# EAGLE design 2wd (EAGLE 7.7.0)
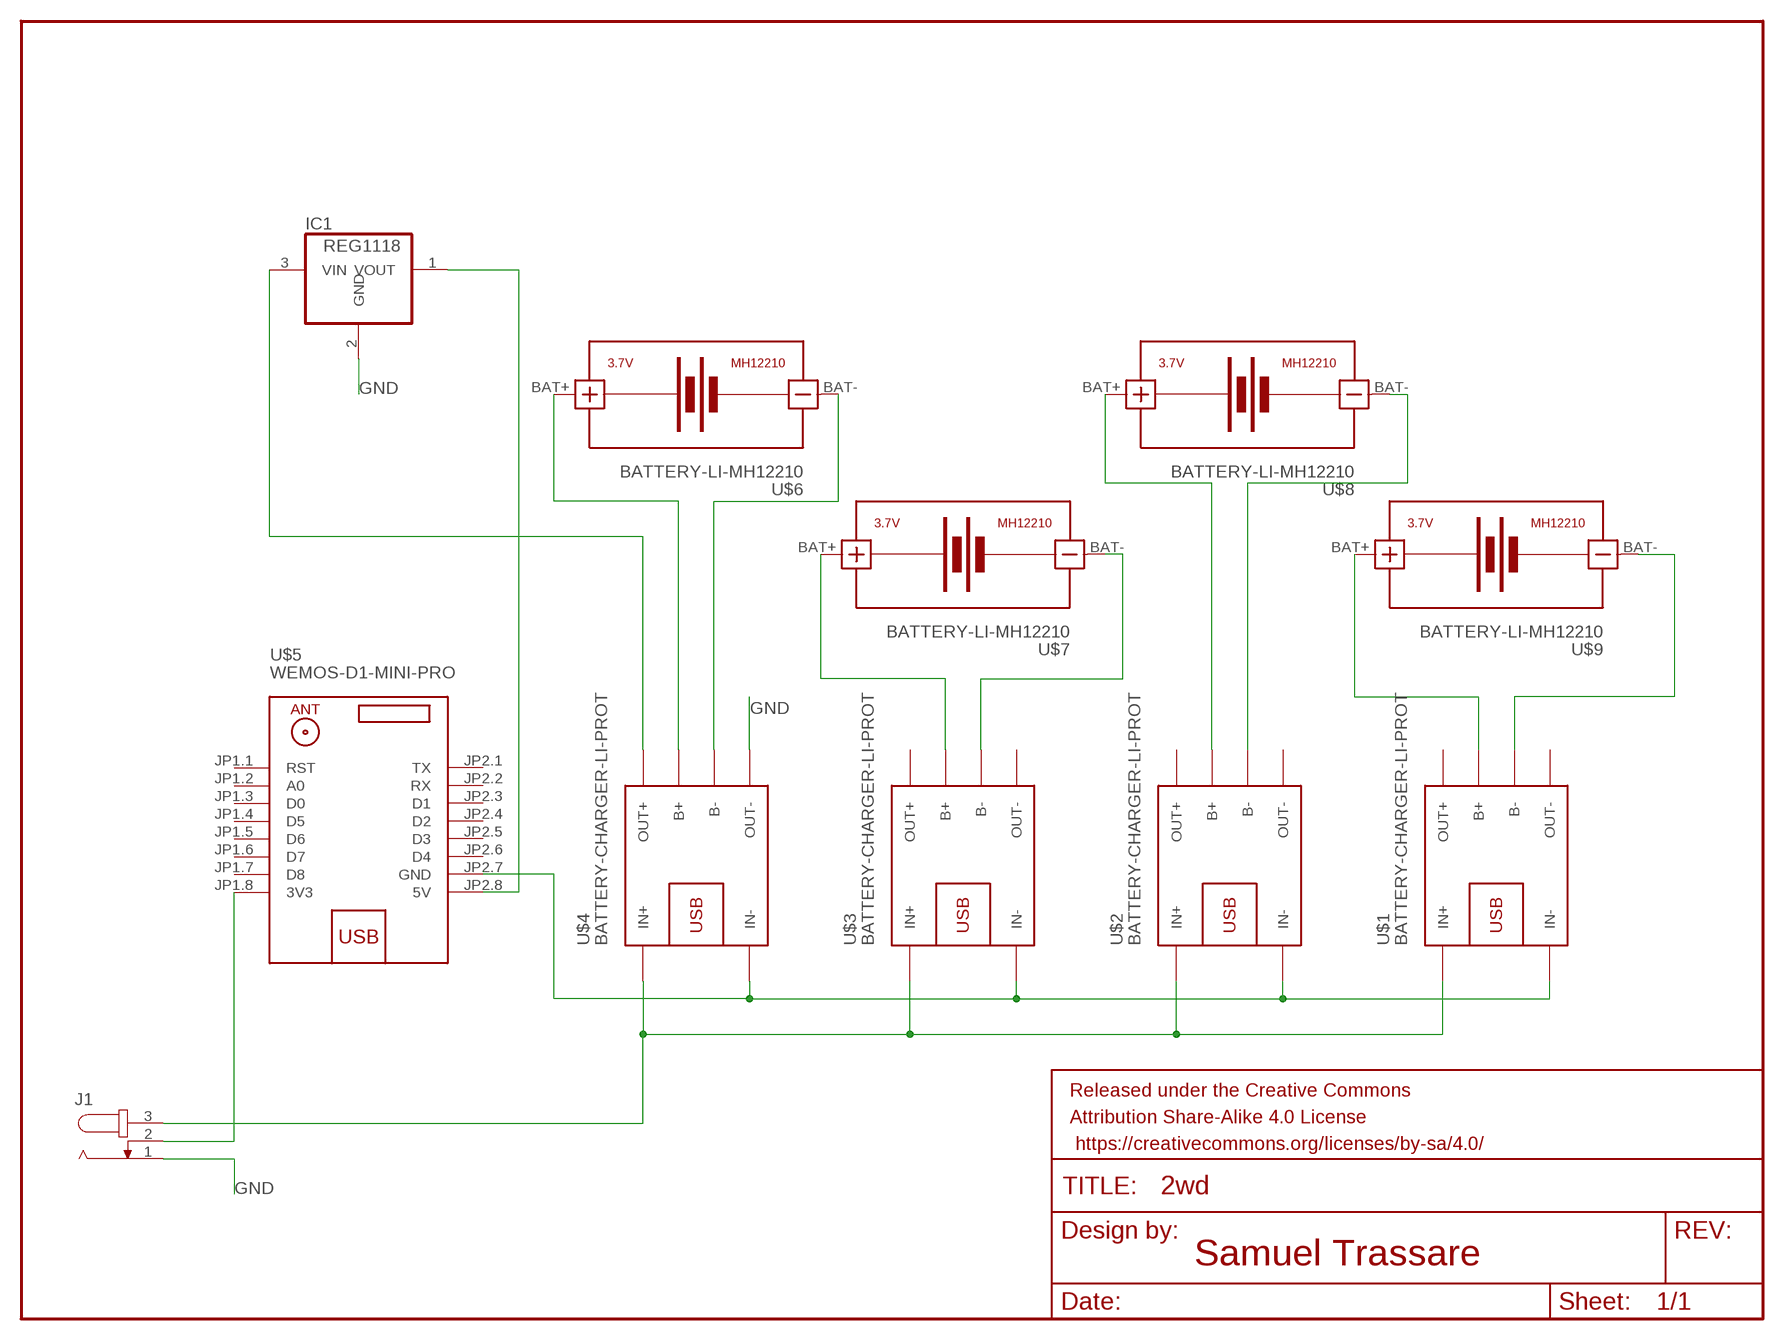
[diagram p0: schematic, sheet 1]

## Parts
FRAME1  FRAME-LETTER  [CREATIVE_COMMONS]
IC1  REG1118  [SOT223]
J1  JACK-PLUG0  [SPC4077]
U$1  BATTERY-CHARGER-LI-PROT  [BATTERY-CHARGER-LI-PROT]
U$2  BATTERY-CHARGER-LI-PROT  [BATTERY-CHARGER-LI-PROT]
U$3  BATTERY-CHARGER-LI-PROT  [BATTERY-CHARGER-LI-PROT]
U$4  BATTERY-CHARGER-LI-PROT  [BATTERY-CHARGER-LI-PROT]
U$5  WEMOS-D1-MINI-PRO  [WEMOS-D1-MINI-PRO]
U$6  BATTERY-LI-MH12210  [BATTERY-LI-MH12210]
U$7  BATTERY-LI-MH12210  [BATTERY-LI-MH12210]
U$8  BATTERY-LI-MH12210  [BATTERY-LI-MH12210]
U$9  BATTERY-LI-MH12210  [BATTERY-LI-MH12210]

## Nets
GND: IC1.2(GND) J1.1 U$1.IN- U$2.IN- U$3.IN- U$4.IN- U$4.OUT- U$5.JP2.7(GND)
N$1: U$1.B- U$9.BAT-
N$2: U$2.B- U$8.BAT-
N$3: U$3.B- U$7.BAT-
N$4: U$4.B- U$6.BAT-
N$5: U$3.B+ U$7.BAT+
N$6: U$2.B+ U$8.BAT+
N$7: U$1.B+ U$9.BAT+
N$8: U$4.B+ U$6.BAT+
N$9: IC1.3(VIN) U$4.OUT+
N$10: IC1.1(VOUT) U$5.JP2.8(5V)
N$11: J1.2 U$5.JP1.8(3V3)
VCC [supply]: J1.3 U$1.IN+ U$2.IN+ U$3.IN+ U$4.IN+
Unconnected: U$1.OUT+ U$1.OUT- U$2.OUT+ U$2.OUT- U$3.OUT+ U$3.OUT- U$5.JP1.1(RST) U$5.JP1.2(A0) U$5.JP1.3(D0) U$5.JP1.4(D5) U$5.JP1.5(D6) U$5.JP1.6(D7) U$5.JP1.7(D8) U$5.JP2.1(TX) U$5.JP2.2(RX) U$5.JP2.3(D1) U$5.JP2.4(D2) U$5.JP2.5(D3) U$5.JP2.6(D4)

## Notes on the sheet
- Samuel Trassare

## Library data of the parts
FRAME1 = SparkFun-Aesthetics:FRAME-LETTER: Schematic Frame - Letter Standard 8.5x11 US Letter frame
IC1 = burr-brown:REG1118: 800mA Low Dropout (LDO) Positive Regulator with Current Source and Sink Capability; MPN: REG1118-2.85/2K5G4; OC_FARNELL: unknown; OC_NEWARK: 14M2185
J1 = con-jack:JACK-PLUG: DC POWER JACK Power Jack, DC, Right Angle, Through Hole, Rated 5A at 16VDC, PC Terminals Distributor: Farnell (www.Farnell.de) Drawing: 84N1161.pdf / 84N1162.pdf Manufacturer: SPC Technology (www.spctechnology.com) Type: SPC4077 / SPC 4078; OC_FARNELL: unknown; OC_NEWARK: unknown
U$1-U$4 = diy-modules:BATTERY-CHARGER-LI-PROT: Lithium Battery 5V Charger with protection circuit More details available here: http://www.instructables.com/id/DIY-Lithium-ion-Battery-Charger/step4/TP4056-based-lithium-ion-battery-charger-module/ Click here to find device on ebay.com <http://www.ebay.com/sch/tp4056+charger+usb+protection>
U$5 = diy-modules:WEMOS-D1-MINI-PRO: WEMOS D1 mini Pro: Mini Wi-Fi Board based on ESP-8266EX chip More details can be found here: https://www.wemos.cc/product/d1-mini-pro.html Click here to find device on ebay.com <http://www.ebay.com/sch/wemos+d1+mini+pro>
U$6-U$9 = diy-modules:BATTERY-LI-MH12210: Lithium-Ion MH12210 Rechargeable Battery Panasonic NCR18650PF battery datasheet available here: https://industrial.panasonic.com/cdbs/www-data/pdf2/ACI4000/ACI4000C12.pdf Click here to find device on ebay.com <http://www.ebay.com/sch/ncr18650b+battery>

## Net classes
0 default: width 0.254 mm, clearance 0.254 mm
1 supply: width 0.508 mm, clearance 0.508 mm

## Board
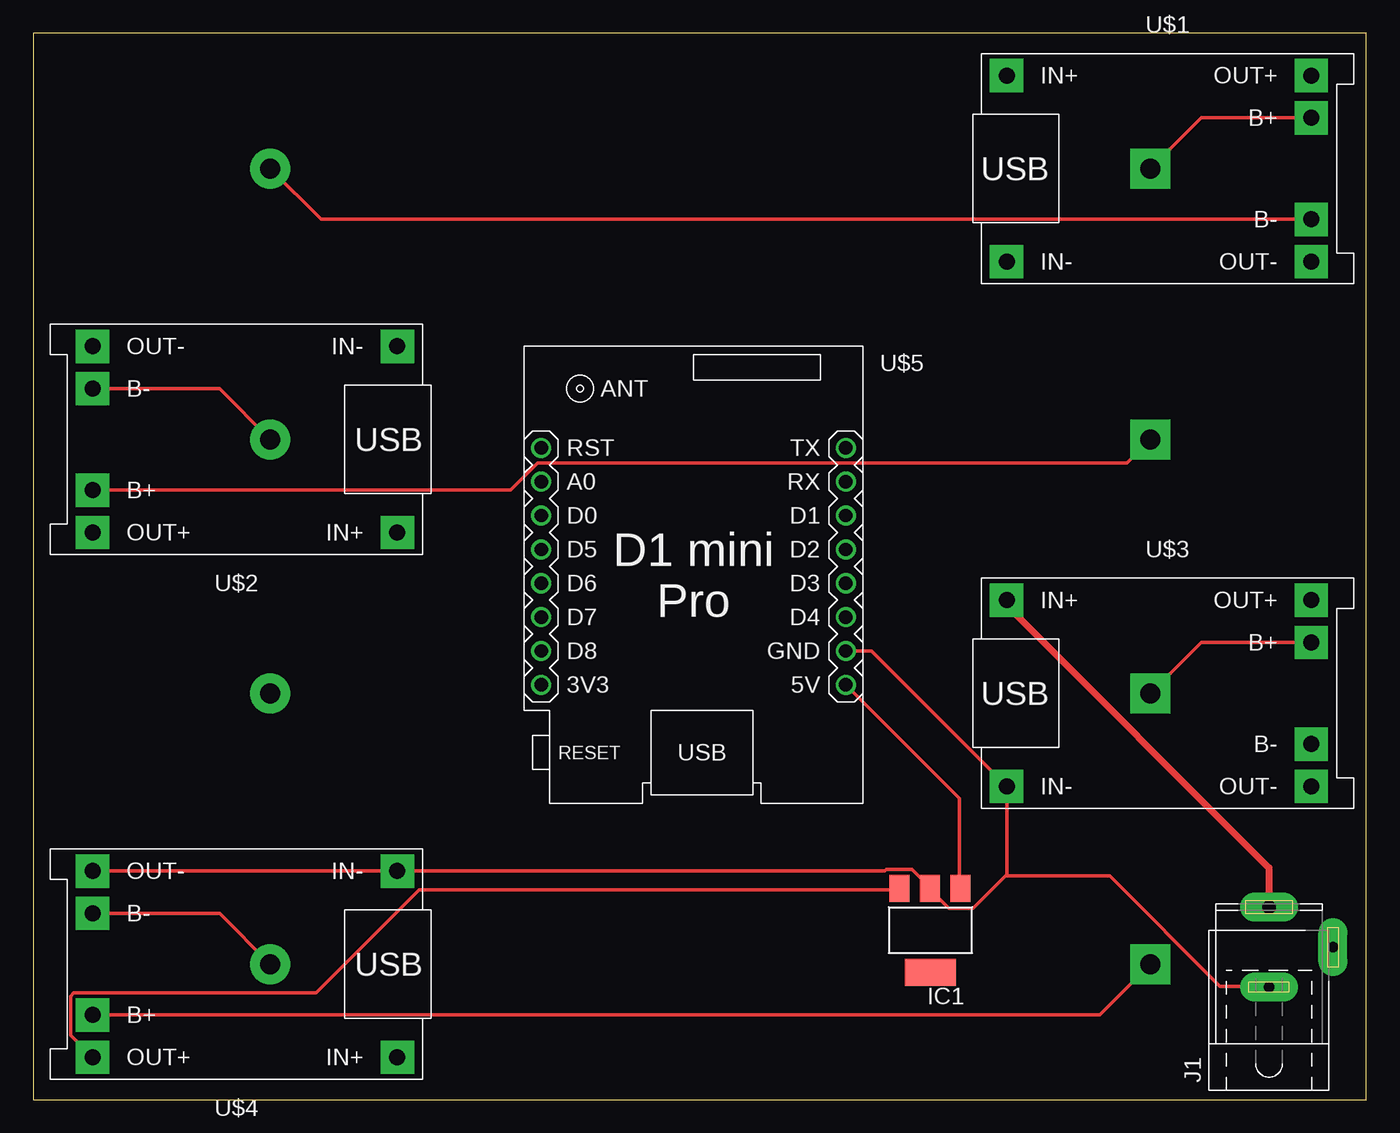
[diagram p1: board, top side]
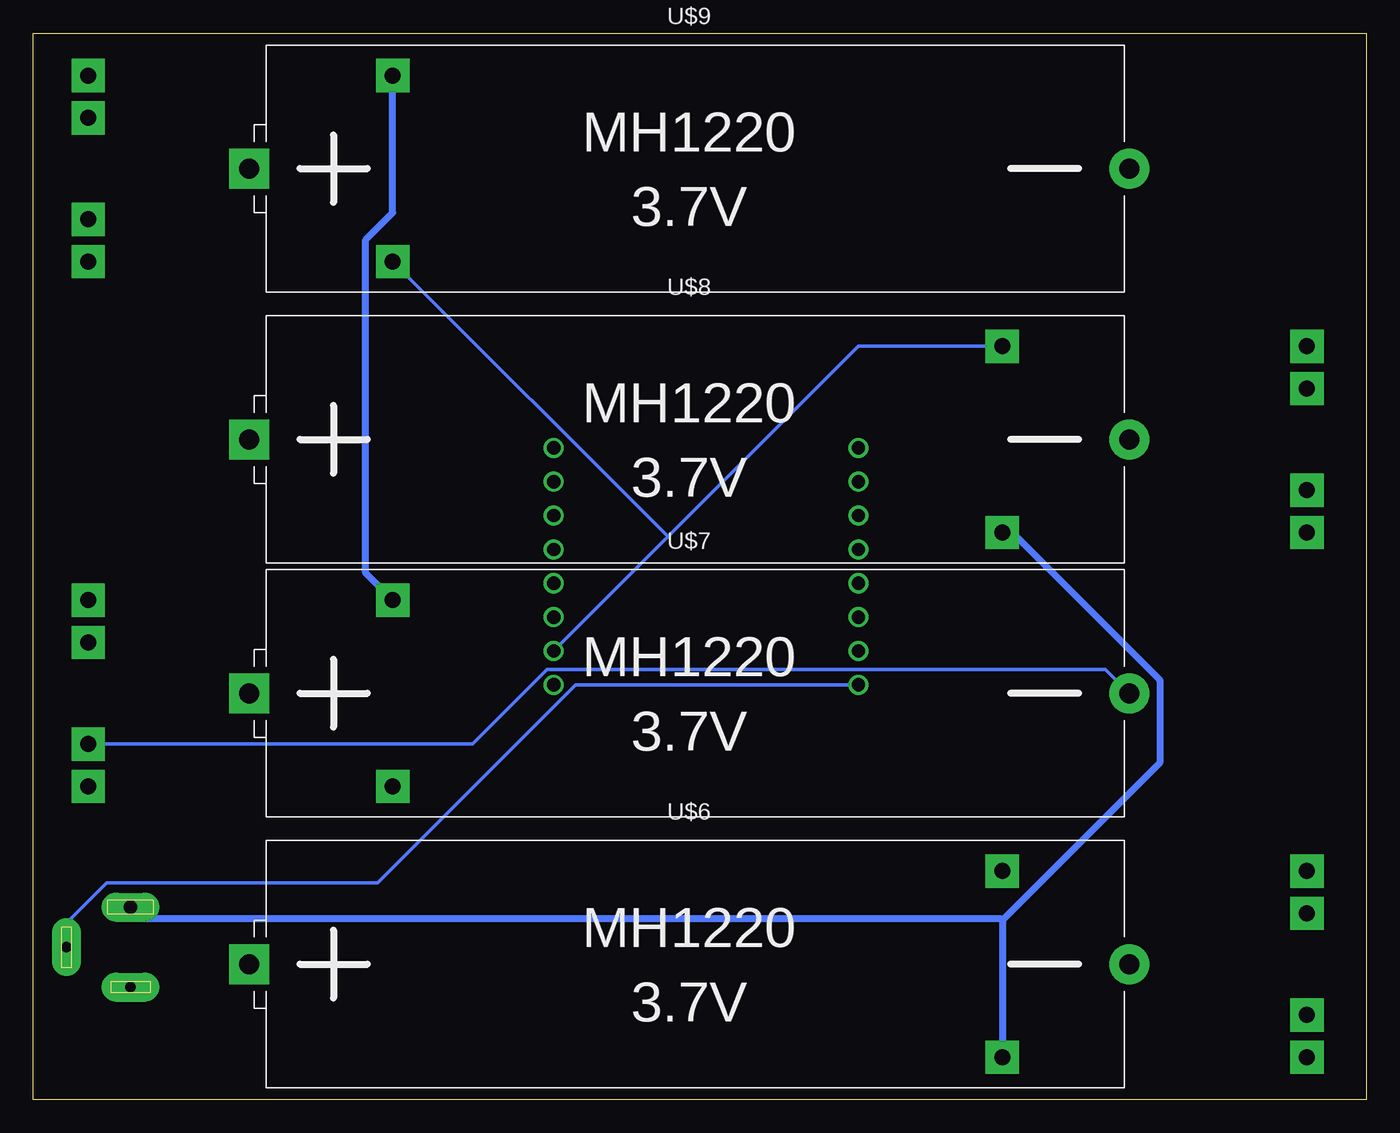
[diagram p2: board, bottom side, seen from below]

Size 100 x 80 mm. Coordinates in mm from the lower left corner, seen from the top.
Outline: 0,0 100,0 100,80 0,80 0,0
Copper layers (1*16): Top 0.035mm / dielectric 1.5mm / Bottom 0.035mm
Design rules "default": minimum track width 10mil, minimum drill 24mil, track to track 8mil, track to pad 8mil, pad to pad 8mil, via to via 8mil, smd to smd 8mil, copper to edge 40mil, drill to drill 8mil, minimum pad ring 10mil, minimum via ring 8mil, stop-mask expansion 4mil, vias tented up to drill 0mil, thermal gap 10mil

### Footprints (pad centres in the part's own frame; a part is rotated, then mirrored left to right if it is on the bottom)
SOT223 = smd 1.499 x 2.007: 1 -2.261,-3.15; 2 0.025,-3.15; 3 2.311,-3.15 | smd 3.81 x 2.007: 4 0,3.15
SPC4077 = drill 0.8 pad 2.184 long: 1 -3,0; 2 0,-4.8 | drill 1 pad 2.184 long: 3 3,0
BATTERY-CHARGER-LI-PROT = drill 1.2 pad 2.5 square: B+ 10.795,3.81; B- 10.795,-3.81; IN+ -12.065,6.985; IN- -12.065,-6.985; OUT+ 10.795,6.985; OUT- 10.795,-6.985
WEMOS-D1-MINI-PRO = drill 1: JP1.1 -11.43,9.525; JP1.2 -11.43,6.985; JP1.3 -11.43,4.445; JP1.4 -11.43,1.905; JP1.5 -11.43,-0.635; JP1.6 -11.43,-3.175; JP1.7 -11.43,-5.715; JP1.8 -11.43,-8.255; JP2.1 11.43,9.525; JP2.2 11.43,6.985; JP2.3 11.43,4.445; JP2.4 11.43,1.905; JP2.5 11.43,-0.635; JP2.6 11.43,-3.175; JP2.7 11.43,-5.715; JP2.8 11.43,-8.255
BATTERY-LI-MH12210 = drill 1.5 pad 3 square: BAT+ -33.02,0 | drill 1.5 pad 3: BAT- 33.02,0

### Placement (x,y rotation side)
FRAME1  16.51,-10.16 0 top  (outside the outline)
IC1  67.31,12.7 180 top
J1  92.71,11.43 90 top
U$1  85.09,69.85 0 top
U$2  15.24,49.53 180 top
U$3  85.09,30.48 0 top
U$4  15.24,10.16 180 top
U$5  49.53,39.37 0 top
U$6  50.8,10.16 0 bottom
U$7  50.8,30.48 0 bottom
U$8  50.8,49.53 0 bottom
U$9  50.8,69.85 0 bottom

### Tracks (layer width: path | path; a pad name or v marks a point on that pad's centre or on a via)
GND
  Top 0.254: U$4.OUT- U$4.IN- 63.88,17.14 64.01,17.27 65.91,17.27 67.31,15.88 IC1.2 67.31,15.75 68.71,14.35 70.48,14.35 72.96,16.83 | 72.96,16.83 73.03,16.89 U$3.IN- 62.87,33.66 U$5.JP2.7 | J1.1 92.71,8.51 89.03,8.51 80.77,16.76 73.03,16.76 72.96,16.83
  Bottom 0.254: U$2.IN- 38.1,56.52 52.39,42.23 | U$5.JP2.7 52.39,42.23 | 52.39,42.23 U$1.IN-
N$1
  Top 0.254: U$1.B- 21.59,66.04 U$9.BAT-
N$2
  Top 0.254: U$2.B- 13.97,53.34 U$8.BAT-
N$3
  Bottom 0.254: U$3.B- 67.06,26.67 61.47,32.26 19.56,32.26 U$7.BAT-
N$4
  Top 0.254: U$4.B- 13.97,13.97 U$6.BAT-
N$5
  Top 0.254: U$3.B+ 87.63,34.29 U$7.BAT+
N$6
  Top 0.254: U$2.B+ 35.81,45.72 37.85,47.75 82.04,47.75 U$8.BAT+
N$7
  Top 0.254: U$1.B+ 87.63,73.66 U$9.BAT+
N$8
  Top 0.254: U$4.B+ 80.01,6.35 U$6.BAT+
N$9
  Top 0.254: U$4.OUT+ 2.79,4.83 2.79,7.75 3.05,8 21.21,8 28.96,15.75 64.9,15.75 IC1.3
N$10
  Top 0.254: U$5.JP2.8 69.47,22.61 69.47,15.88 IC1.1
N$11
  Bottom 0.254: U$5.JP1.8 59.31,31.11 74.17,16.26 94.49,16.26 97.41,13.34 97.41,11.43 J1.2
VCC
  Top 0.508: J1.3 92.71,17.4 73.03,37.08 U$3.IN+
  Bottom 0.508: 27.3,13.46 U$4.IN+ | 27.3,13.46 15.49,25.27 15.49,31.5 26.54,42.55 U$2.IN+ | U$1.IN+ 73.03,66.55 75.06,64.52 75.06,39.5 U$3.IN+ | 27.3,13.46 27.43,13.59 91.95,13.59 92.71,14.35 J1.3